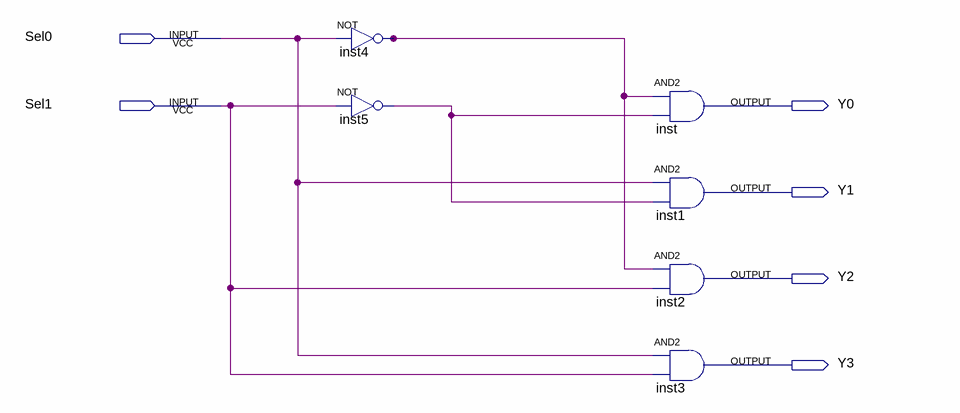
[diagram p0: schematic sheet]
// Quartus schematic decoder2to4_block.bdf as structural Verilog: 6 symbols, 6 pins
module decoder2to4_block (
  input  Sel0,
  input  Sel1,
  output Y0,
  output Y1,
  output Y2,
  output Y3
);

  wire inst4_out, inst5_out;

  not inst4 (inst4_out, Sel0);
  not inst5 (inst5_out, Sel1);
  and inst (Y0, inst4_out, inst5_out);
  and inst1 (Y1, Sel0, inst5_out);
  and inst2 (Y2, inst4_out, Sel1);
  and inst3 (Y3, Sel0, Sel1);
endmodule
